# EAGLE design TriacDimmer (EAGLE 6.5.0)
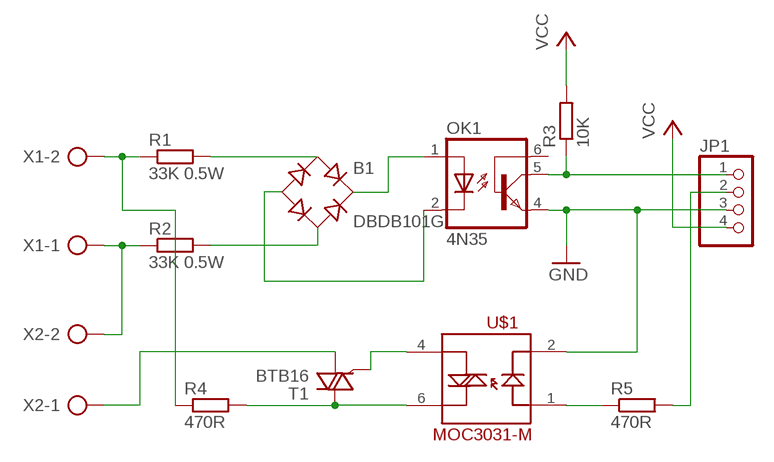
[diagram p0: schematic, sheet 1]

## Parts
B1  DBDB101G  [DB]
JP1  PINHD-1X4  [1X04]
OK1  4N35  [DIL06]
R1  33K 0.5W  R-EU_0207/10  [0207/10]
R2  33K 0.5W  R-EU_0207/10  [0207/10]
R3  10K  R-EU_0207/10  [0207/10]
R4  470R  R-EU_0207/10  [0207/10]
R5  470R  R-EU_0207/10  [0207/10]
T1  BTB16  BT138-V  [TO220BV]
U$1  MOC3031-M  [DIL06]
X1  AK300/2  [AK300/2]
X2  AK300/2  [AK300/2]

## Nets
GND: JP1.3 OK1.4(EMI) U$1.2
N$1: R1.1 R4.1 X1.2
N$2: R2.1 X1.1 X2.2
N$3: B1.AC1 R1.2
N$4: B1.AC2 R2.2
N$5: B1.+ OK1.1(A)
N$6: B1.- OK1.2(C)
N$7: JP1.1 OK1.5(COL) R3.1
N$8: JP1.2 R5.2
N$11: R4.2 T1.T2(A2) U$1.6
N$13: T1.G U$1.4
N$14: T1.T1(A1) X2.1
N$15: R5.1 U$1.1
VCC: JP1.4 R3.2
Unconnected: OK1.6(BAS)

## Library data of the parts
B1 = rectifier:DB?*G: Single Phase 1.0 AMP Glass Passivated Bridge Rectifier Taiwan Semiconductor Co.,Ltd. - TSC Source: http://www.taiwansemi.com/TSCbig5/ezcatfiles/cust/img/img/db101g.pdf http://www.ts.com.tw/db/pictures/modules/PDT/PDT060207001/DBLS201G.pdf
JP1 = pinhead:PINHD-1X4: PIN HEADER
OK1 = optocoupler:4N35: MOTOROLA OPTO COUPLER; MF: FAIRCHILD SEMICONDUCTOR; MPN: 4N35; OC_FARNELL: 1328375; OC_NEWARK: 72K9946
R1-R5 = rcl:R-EU_: RESISTOR, European symbol
T1 = triac:BT138: TRIAC Source: http://www.semiconductors.philips.com BT138_SERIES_2.pdf
U$1 = SparkFun-DiscreteSemi:MOC3031-M: Opto-isolated TRIAC
X1 X2 = con-ptr500:AK300/2: CONNECTOR; OC_FARNELL: unknown; OC_NEWARK: unknown

## Board
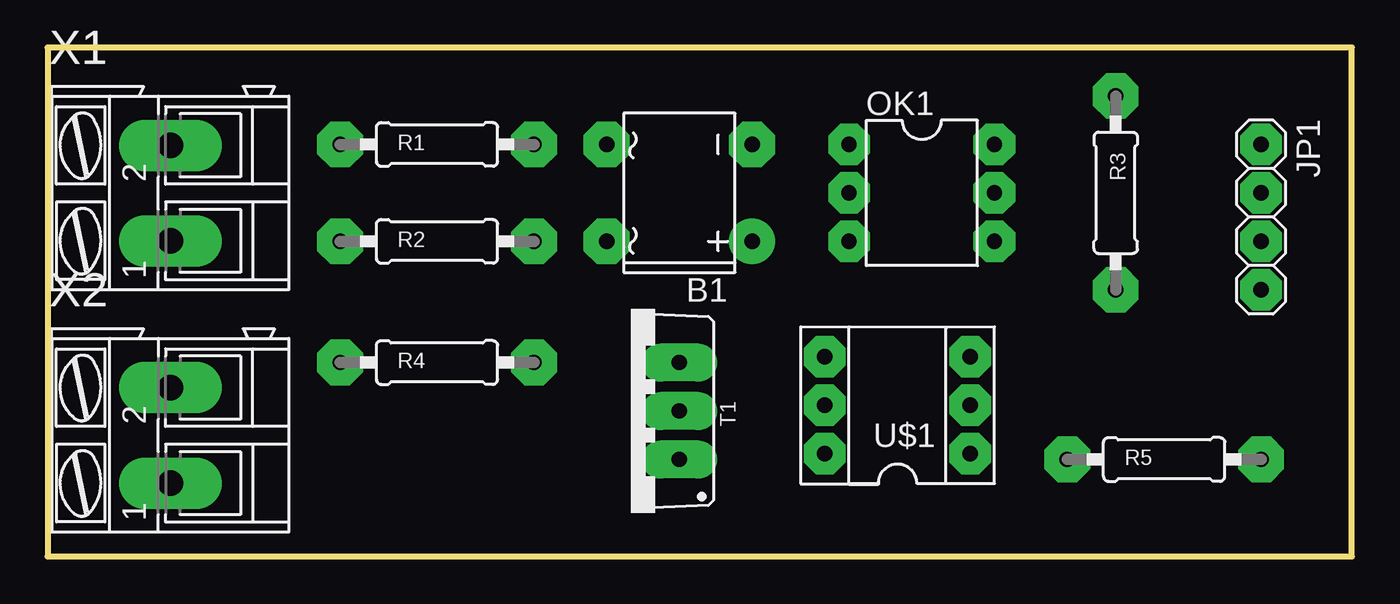
[diagram p1: board, top side]
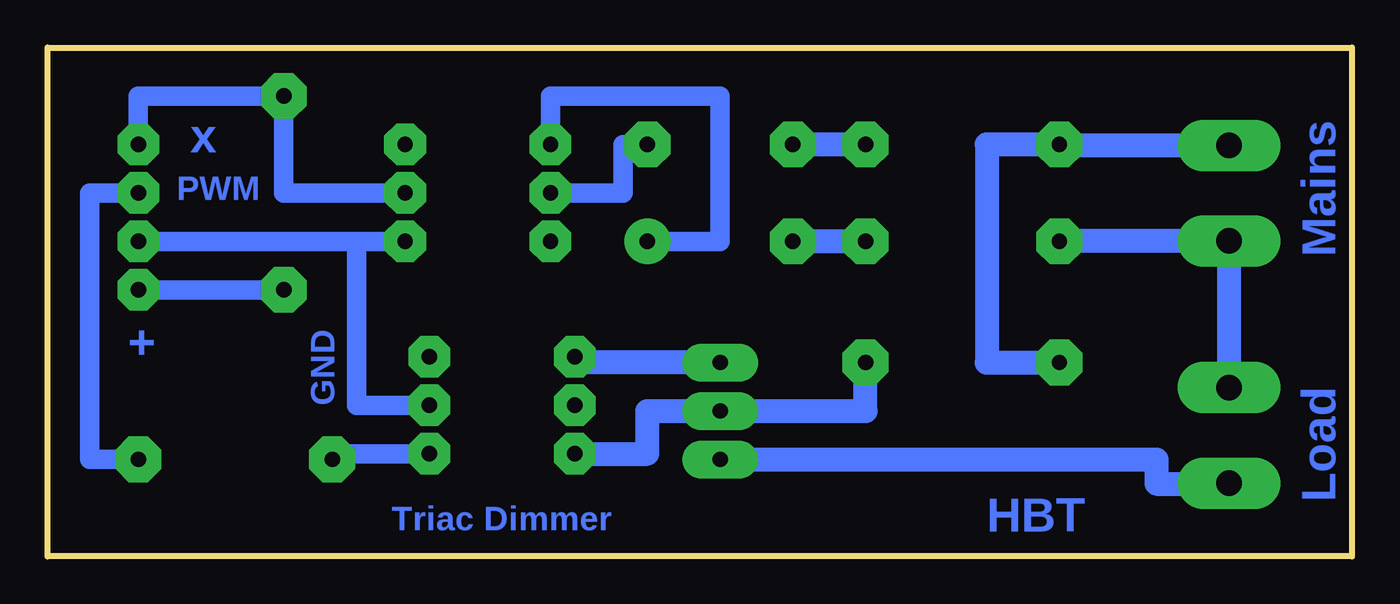
[diagram p2: board, bottom side, seen from below]

Size 68.32 x 26.66 mm. Coordinates in mm from the lower left corner, seen from the top.
Outline: 0,0 68.32,0 68.32,26.66 0,26.66 0,0
Copper layers (1*16): Top 0.035mm / dielectric 1.5mm / Bottom 0.035mm
Design rules "default": minimum track width 10mil, minimum drill 24mil, track to track 8mil, track to pad 8mil, pad to pad 8mil, via to via 8mil, smd to smd 8mil, copper to edge 40mil, drill to drill 8mil, minimum pad ring 10mil, minimum via ring 8mil, stop-mask expansion 4mil, vias tented up to drill 0mil, thermal gap 10mil

### Footprints (pad centres in the part's own frame; a part is rotated, then mirrored left to right if it is on the bottom)
DB = drill 0.813 pad 2.4: + -2.54,-3.81 | drill 0.813 pad 2.4 octagon: - 2.54,-3.81; AC1 2.54,3.81; AC2 -2.54,3.81
1X04 = drill 0.8 pad 2.184 octagon: 1 -3.81,0; 2 -1.27,0; 3 1.27,0; 4 3.81,0
DIL06 = drill 0.8 pad 2.184 octagon: 1 -2.54,-3.81; 2 0,-3.81; 3 2.54,-3.81; 4 2.54,3.81; 5 0,3.81; 6 -2.54,3.81
0207/10 = drill 0.8 pad 2.4 octagon: 1 -5.08,0; 2 5.08,0
TO220BV = drill 0.8 pad 2 long: G 2.54,-2.54; T1 -2.54,-2.54; T2 0,-2.54
DIL06' = drill 0.8 pad 2.184 octagon: 1 -3.51,-3.81; 2 -0.97,-3.81; 3 1.57,-3.81; 4 1.57,3.81; 5 -0.97,3.81; 6 -3.51,3.81
AK300/2 = drill 1.321 pad 2.7 long: 1 -2.515,0; 2 2.489,0

### Placement (x,y rotation side)
B1  33.09,19.05 90 top
JP1  63.57,17.78 270 top
OK1  45.79,19.05 270 top
R1  20.39,21.59 0 top
R2  20.39,16.51 0 top
R3  55.95,19.05 270 top
R4  20.39,10.16 0 top
R5  58.49,5.08 0 top
T1  30.55,7.62 90 top
U$1  MOC3031-M  [DIL06']  44.52,8.89 90 top
X1  6.42,19.05 90 top
X2  6.42,6.35 90 top

### Tracks (layer width: path | path; a pad name or v marks a point on that pad's centre or on a via)
GND
  Bottom 1.016: OK1.4 52.14,16.51 | 52.14,16.51 JP1.3 | U$1.2 52.14,7.92 52.14,16.51
N$1
  Bottom 1.016: 15.31,21.54 R1.1
  Bottom 1.27: X1.2 15.31,21.54 | R1.1 19.12,21.59 19.12,10.16 R4.1
N$2
  Bottom 1.016: 15.31,16.54 R2.1
  Bottom 1.27: 15.31,16.54 X1.1 X2.2
N$3
  Bottom 1.27: R1.2 B1.AC1
N$4
  Bottom 1.27: R2.2 B1.AC2
N$5
  Bottom 1.016: B1.+ 33.09,16.51 33.09,24.13 41.98,24.13 OK1.1
N$6
  Bottom 1.016: B1.- 38.17,21.59 38.17,19.05 OK1.2
N$7
  Bottom 1.016: OK1.5 55.95,19.05 R3.1 63.57,24.13 JP1.1
N$8
  Bottom 1.016: R5.2 66.11,5.08 66.11,19.05 JP1.2
N$11
  Bottom 1.27: U$1.6 36.9,5.38 36.9,7.62 T1.T2 25.47,7.62 R4.2
N$13
  Bottom 1.016: 40.71,10.16 U$1.4
  Bottom 1.27: T1.G 40.71,10.16
N$14
  Bottom 1.016: 6.42,3.81 X2.1
  Bottom 1.27: T1.T1 10.23,5.08 10.23,3.81 6.42,3.81
N$15
  Bottom 1.016: U$1.1 53.41,5.38 R5.1
VCC
  Bottom 1.016: R3.2 JP1.4

### Text on the board
Bottom: Mains | x | PWM | GND | + | Load | HBT | Triac Dimmer